# EAGLE design switchy-stamp-buckeroo-mk-1 (EAGLE 6.5.0)
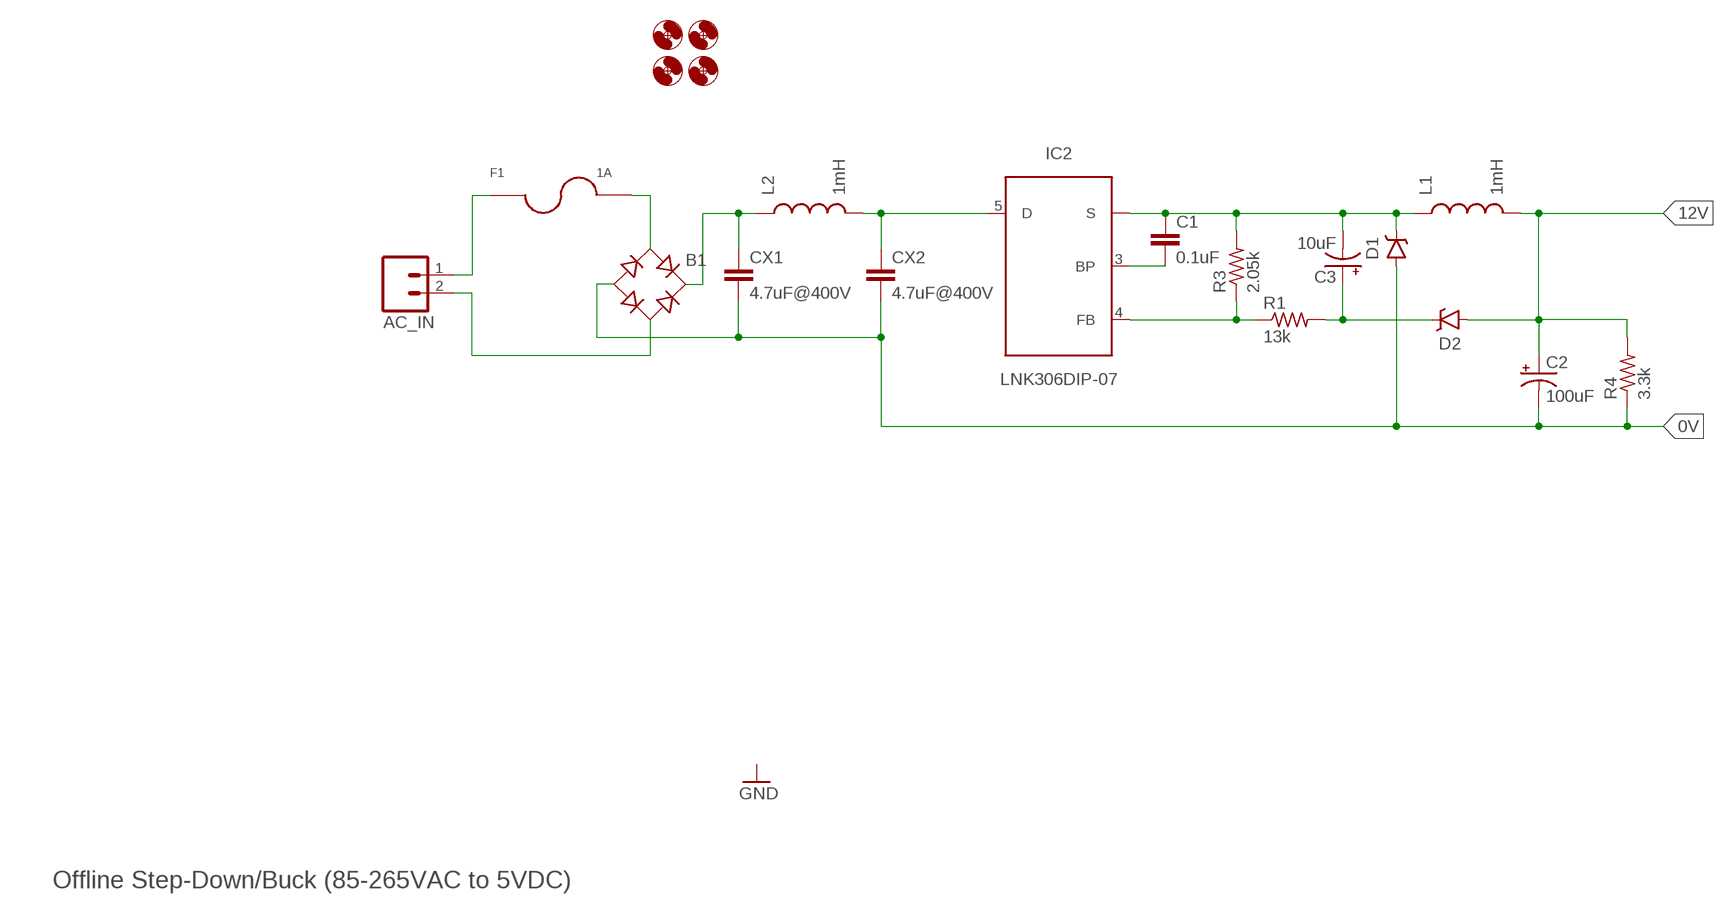
[diagram p0: schematic, sheet 1]

## Parts
AC_IN  M023.5MM  [SCREWTERMINAL-3.5MM-2]
B1  RB1ANOSUCK  [RB1A-NOSUCK]
C1  0.1uF  CAPACITOR-CERAMIC025-024X044  [C025-024X044]
C2  100uF  CAPACITOR-POLARIZEDE3.5-8  [E3,5-8]
C3  10uF  CAPACITOR-POLARIZEDE3.5-8  [E3,5-8]
CX1  4.7uF@400V  CXXC10B5  [XC10B5]
CX2  4.7uF@400V  CXXC10B5  [XC10B5]
D1  1N5819  DIODE-SCHOTTKYPTH-10.16MM  [DIODE-10.16MM]
D2  1N5819  DIODE-SCHOTTKYPTH-10.16MM  [DIODE-10.16MM]
F1  1A  FUSE5X20MM-2  [FUSE-2AG]
H1  HOLE#2  [HOLE-#2]
H2  HOLE#2  [HOLE-#2]
H3  HOLE#2  [HOLE-#2]
H4  HOLE#2  [HOLE-#2]
IC2  LNK306DIP-07  [DIP-07]
L1  1mH  INDUCTORAXIAL-PTH-10.16MM  [INDUCTOR-AXIAL-PTH-10.16MM]
L2  1mH  INDUCTORAXIAL-PTH-10.16MM  [INDUCTOR-AXIAL-PTH-10.16MM]
R1  13k  RESISTORPTH-AXIAL-6.35MM  [RESISTOR-AXIAL-PTH-6.35MM]
R3  2.05k  RESISTORPTH-AXIAL-6.35MM  [RESISTOR-AXIAL-PTH-6.35MM]
R4  3.3k  RESISTORPTH-AXIAL-6.35MM  [RESISTOR-AXIAL-PTH-6.35MM]

## Nets
0V: B1.- C2.- CX1.2 CX2.2 D1.A R4.P$1
12V: C2.+ D2.A L1.P$2 R4.P$2
N$1: IC2.4(FB) R1.P$1 R3.P$1
N$2: C3.+ D2.C R1.P$2
N$4: B1.AC1 F1.2 F1.2@2
N$8: AC_IN.1 F1.1 F1.1@1
N$10: B1.+ CX1.1 L2.P$1
N$11: AC_IN.2 B1.AC2
N$13: CX2.1 IC2.5(D) L2.P$2
N$14: C1.1 C3.- D1.C IC2.1(S) IC2.2(S) IC2.7(S) IC2.8(S) L1.P$1 R3.P$2
N$15: C1.2 IC2.3(BP)

## Notes on the sheet
- Offline Step-Down/Buck (85-265VAC to 5VDC)

## Library data of the parts
AC_IN = A_butts:M02: Standard 2-pin 0.1" header. Use with - straight break away headers ( PRT-00116) - right angle break away headers (PRT-00553) - swiss pins (PRT-00743) - machine pins (PRT-00117) - female headers (PRT-00115) Molex polarized connector foot print use with: PRT-08233 with associated crimp pins and housings. 2.54_SCREWTERM for use with PRT-10571. 3.5mm Screw Terminal footprints for PRT-08084 5mm Screw Terminal footprints for use with PRT-08433
B1 = A_butts:RB1A: RECTIFIER 1 A
C1 = A_butts:CAPACITOR-CERAMIC: CAPACITOR, European symbol
C2 C3 = A_butts:CAPACITOR-POLARIZED: POLARIZED CAPACITOR, American symbol
CX1 CX2 = A_butts:CX: X CAPACITOR for power line
D1 D2 = A_butts:DIODE-SCHOTTKY: Schottky diodes in SFE's production catalog BAT20J 1A 23V 0.62Vf RB751 120mA 40V 0.37Vf PMEG4005EJ 0.5A 40V 0.42Vf MBRA140 1A 40V 0.5Vf B340A 3A 40V SMA
F1 = A_butts:FUSE
H1-H4 = A_butts:HOLE: MOUNTING HOLE with drill center marker
IC2 = A_butts:LNK306
L1 L2 = A_butts:INDUCTOR: Inductors Basic Inductor/Choke - 0603 and 1206. Footprints are not proven and vary greatly between part numbers. SRN6045- 33uH, 20% 1.4A SDR0403-560KL - 56uH, 10%, 500mA RMS/740mA peak
R1 R3 R4 = A_butts:RESISTOR: RESISTOR, American symbol

## Board
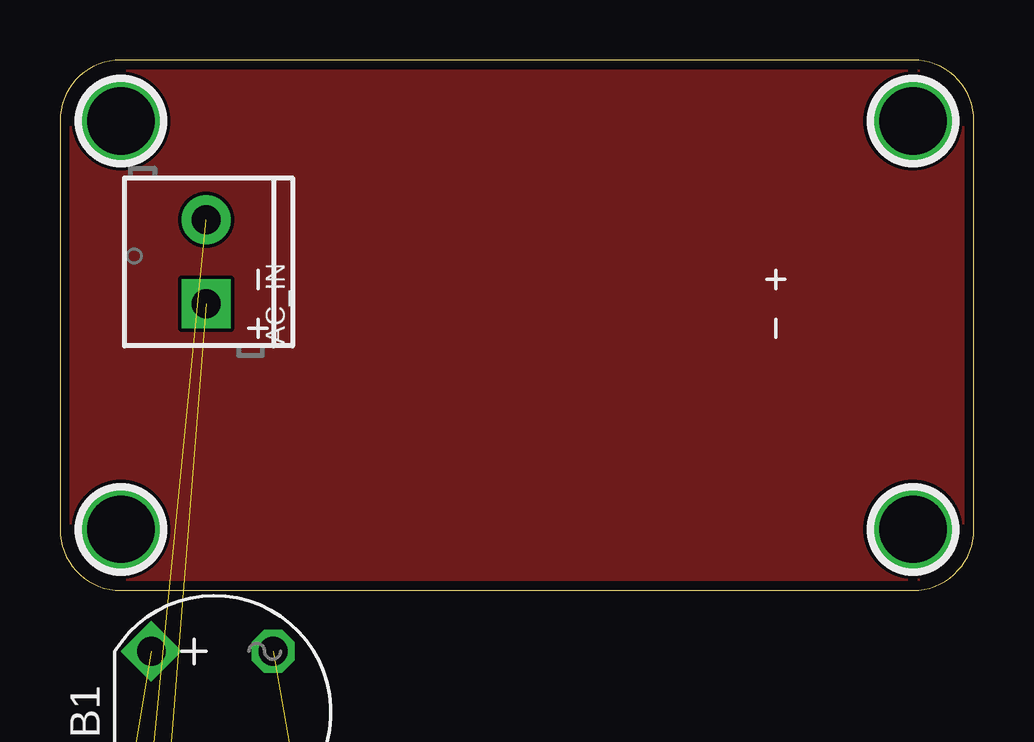
[diagram p1: board, top side]
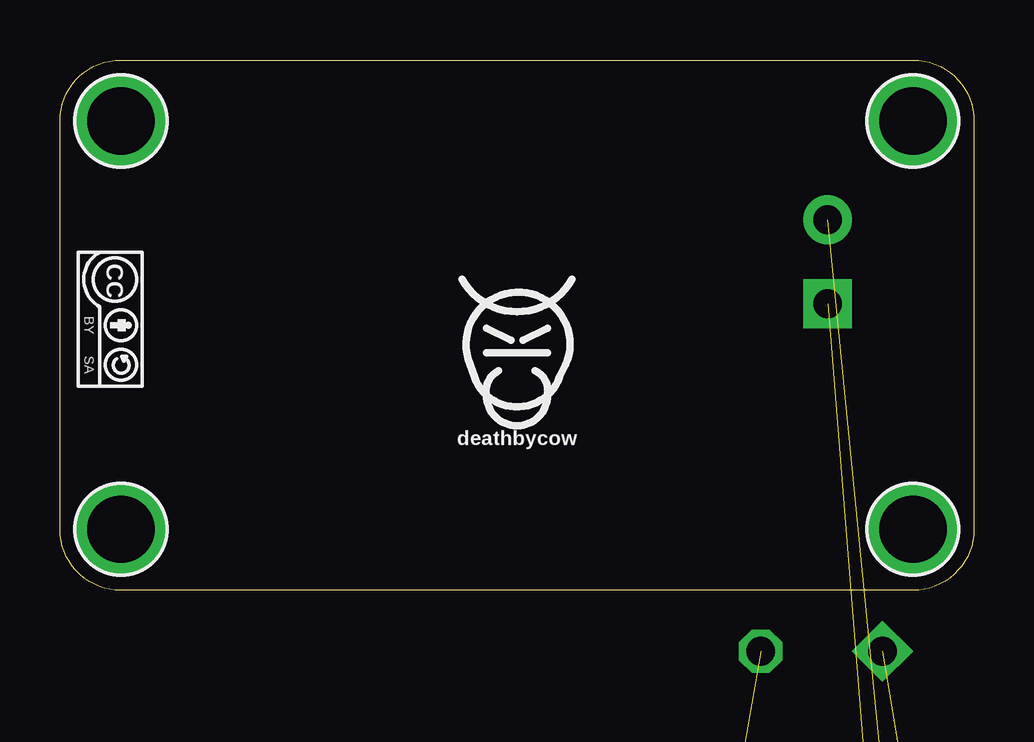
[diagram p2: board, bottom side, seen from below]

Size 38.1 x 22.1 mm. Coordinates in mm from the lower left corner, seen from the top.
Outline: 0,19.56 0,2.54 arc90 2.54,0 35.56,0 arc90 38.1,2.54 38.1,19.56 arc90 35.56,22.1 2.54,22.1 arc90 0,19.56
Copper layers (1*16): Top 0.0356mm / dielectric 1.5011mm / Bottom 0.0356mm
Design rules "LaenPCBOrder2": minimum track width 6mil, minimum drill 13mil, track to track 6mil, track to pad 6mil, pad to pad 6mil, via to via 6mil, smd to smd 6mil, copper to edge 15mil, drill to drill 6mil, minimum pad ring 7mil, minimum via ring 7mil, stop-mask expansion 3mil, vias tented up to drill 20mil, thermal gap 10mil

### Footprints (pad centres in the part's own frame; a part is rotated, then mirrored left to right if it is on the bottom)
SCREWTERMINAL-3.5MM-2 = drill 1.2 pad 2.032 square: 1 0,0 | drill 1.2 pad 2.032: 2 3.5,0
RB1A-NOSUCK = drill 1.2 pad 1.778 square: + -2.54,2.54 | drill 1.2 pad 1.778 octagon: - 2.54,-2.54; AC1 2.54,2.54; AC2 -2.54,-2.54
C025-024X044 = drill 0.813 pad 1.676 octagon: 1 -1.27,0; 2 1.27,0
E3,5-8 = drill 1.016 pad 1.93 square: + -1.778,0 | drill 1.016 pad 1.93 octagon: - 1.778,0
XC10B5 = drill 1.016 octagon: 1 -5.08,0; 2 5.08,0
DIODE-10.16MM = drill 1 pad 1.88 octagon: A -5.08,0; C 5.08,0
FUSE-2AG = drill 1.3 pad 2.2: 1 -10,2.5; 1@1 -10,-2.5; 2 10,2.5; 2@2 10,-2.5
HOLE-#2 = drill 2.8 pad 3.81: P$1 0,0
DIP-07 = drill 1.016 pad 1.727 square: 1 -3.81,-3.81 | drill 1.016 pad 1.727 octagon: 2 -1.27,-3.81; 3 1.27,-3.81; 4 3.81,-3.81; 5 3.81,3.81; 7 -1.27,3.81; 8 -3.81,3.81
INDUCTOR-AXIAL-PTH-10.16MM = drill 1.27 pad 1.93 octagon: P$1 -5.08,0; P$2 5.08,0
RESISTOR-AXIAL-PTH-6.35MM = drill 0.9 pad 1.676 octagon: P$1 -3.175,0; P$2 3.175,0

### Placement (x,y rotation side)
AC_IN  6.1,11.94 90 top
B1  6.35,-5.08 0 top
C1  -0.76,-106.17 0 top  (outside the outline)
C2  0.25,-100.08 0 top  (outside the outline)
C3  0.25,-112.01 0 top  (outside the outline)
CX1  6.86,-14.73 0 top  (outside the outline)
CX2  6.86,-40.89 0 top  (outside the outline)
D1  2.29,-124.46 0 top  (outside the outline)
D2  2.29,-127.51 0 top  (outside the outline)
F1  9.91,-68.07 0 top  (outside the outline)
H1  2.54,2.54 0 top
H2  2.54,19.56 0 top
H3  35.56,2.54 0 top
H4  35.56,19.56 0 top
IC2  6.6,-31.24 0 top  (outside the outline)
L1  3.05,-77.22 0 top  (outside the outline)
L2  3.05,-74.17 0 top  (outside the outline)
R1  1.27,-80.26 0 top  (outside the outline)
R3  1.27,-121.16 0 top  (outside the outline)
R4  1.27,-118.11 0 top  (outside the outline)
U$1  [COW_SMALL]  19.05,10.41 0 bottom
U$2  [CC-BY-SA-4.0-NO-URL]  35.81,12.95 270 bottom

### Tracks (layer width: path | path; a pad name or v marks a point on that pad's centre or on a via)
0V  (5 unrouted)
  pour Top: 35.56,0 2.54,0 arc-90 0,2.54 0,19.56 arc-90 2.54,22.1 35.56,22.1 arc-90 38.1,19.56 38.1,2.54 arc-90
12V  (3 unrouted)
N$1  (2 unrouted)
N$2  (2 unrouted)
N$4  (2 unrouted)
N$8  (2 unrouted)
N$10  (2 unrouted)
N$11  (1 unrouted)
N$13  (2 unrouted)
N$14  (8 unrouted)
N$15  (1 unrouted)